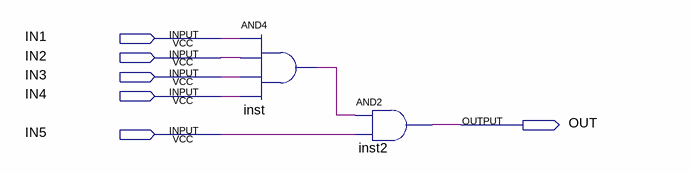
[diagram p0: schematic sheet]
// Quartus schematic and_5b.bdf as structural Verilog: 2 symbols, 6 pins
module and_5b (
  input  IN1,
  input  IN2,
  input  IN3,
  input  IN4,
  input  IN5,
  output OUT
);

  wire inst_out;

  and inst (inst_out, IN1, IN2, IN3, IN4);
  and inst2 (OUT, inst_out, IN5);
endmodule
